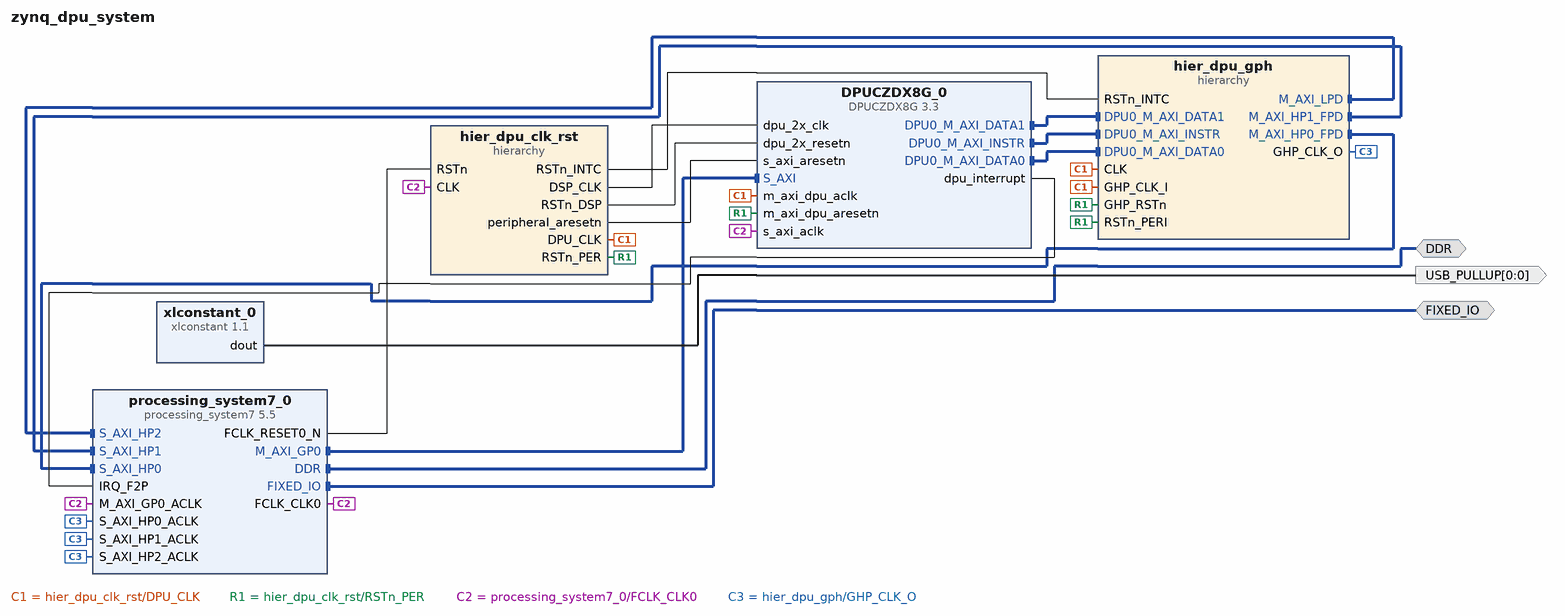
[diagram p0: block diagram of the top level]
# Vivado block design zynq_dpu_system, xc7z020clg484-1, Vivado 2020.2
create_bd_design zynq_dpu_system

create_bd_intf_port -mode Master -vlnv xilinx.com:interface:ddrx_rtl:1.0 DDR
create_bd_intf_port -mode Master -vlnv xilinx.com:display_processing_system7:fixedio_rtl:1.0 FIXED_IO
create_bd_port -dir O -from 0 -to 0 USB_PULLUP

create_bd_cell -type ip -vlnv xilinx.com:ip:processing_system7:5.5 processing_system7_0
set_property -dict [list \
  CONFIG.PCW_APU_PERIPHERAL_FREQMHZ 666.666667 \
  CONFIG.PCW_ENET0_ENET0_IO {MIO 16 .. 27} \
  CONFIG.PCW_ENET0_GRP_MDIO_ENABLE 1 \
  CONFIG.PCW_ENET0_GRP_MDIO_IO {MIO 52 .. 53} \
  CONFIG.PCW_ENET0_PERIPHERAL_ENABLE 1 \
  CONFIG.PCW_ENET0_RESET_ENABLE 0 \
  CONFIG.PCW_ENET_RESET_ENABLE 1 \
  CONFIG.PCW_ENET_RESET_SELECT {Share reset pin} \
  CONFIG.PCW_FPGA0_PERIPHERAL_FREQMHZ 100.000000 \
  CONFIG.PCW_FPGA1_PERIPHERAL_FREQMHZ 150.000000 \
  CONFIG.PCW_GPIO_MIO_GPIO_ENABLE 1 \
  CONFIG.PCW_GPIO_MIO_GPIO_IO MIO \
  CONFIG.PCW_I2C_RESET_ENABLE 1 \
  CONFIG.PCW_IRQ_F2P_INTR 1 \
  CONFIG.PCW_PRESET_BANK1_VOLTAGE {LVCMOS 1.8V} \
  CONFIG.PCW_QSPI_GRP_SINGLE_SS_ENABLE 1 \
  CONFIG.PCW_QSPI_GRP_SINGLE_SS_IO {MIO 1 .. 6} \
  CONFIG.PCW_QSPI_PERIPHERAL_ENABLE 1 \
  CONFIG.PCW_QSPI_QSPI_IO {MIO 1 .. 6} \
  CONFIG.PCW_SD0_GRP_CD_ENABLE 1 \
  CONFIG.PCW_SD0_GRP_CD_IO {MIO 47} \
  CONFIG.PCW_SD0_GRP_WP_ENABLE 1 \
  CONFIG.PCW_SD0_GRP_WP_IO {MIO 46} \
  CONFIG.PCW_SD0_PERIPHERAL_ENABLE 1 \
  CONFIG.PCW_SD0_SD0_IO {MIO 40 .. 45} \
  CONFIG.PCW_SDIO_PERIPHERAL_FREQMHZ 50 \
  CONFIG.PCW_SINGLE_QSPI_DATA_MODE x4 \
  CONFIG.PCW_TTC0_PERIPHERAL_ENABLE 1 \
  CONFIG.PCW_TTC0_TTC0_IO EMIO \
  CONFIG.PCW_UART1_PERIPHERAL_ENABLE 1 \
  CONFIG.PCW_UART1_UART1_IO {MIO 48 .. 49} \
  CONFIG.PCW_UART_PERIPHERAL_FREQMHZ 50 \
  CONFIG.PCW_UIPARAM_DDR_FREQ_MHZ 533.333313 \
  CONFIG.PCW_UIPARAM_DDR_PARTNO {MT41J128M16 HA-15E} \
  CONFIG.PCW_USB0_PERIPHERAL_ENABLE 1 \
  CONFIG.PCW_USB0_RESET_ENABLE 0 \
  CONFIG.PCW_USB0_USB0_IO {MIO 28 .. 39} \
  CONFIG.PCW_USB_RESET_ENABLE 1 \
  CONFIG.PCW_USB_RESET_SELECT {Share reset pin} \
  CONFIG.PCW_USE_FABRIC_INTERRUPT 1 \
  CONFIG.PCW_USE_S_AXI_HP0 1 \
  CONFIG.PCW_USE_S_AXI_HP1 1 \
  CONFIG.PCW_USE_S_AXI_HP2 1 \
  CONFIG.preset ZedBoard \
] [get_bd_cells processing_system7_0]
# 223 more settings of processing_system7_0 are not shown: defaults, MIO pin electricals, DDR timing, and values the tool derives
create_bd_cell -type ip -vlnv xilinx.com:ip:DPUCZDX8G:3.3 DPUCZDX8G_0
set_property -dict [list \
  CONFIG.ARCH 1152 \
  CONFIG.TIME_DAY 10 \
  CONFIG.TIME_HOUR 21 \
  CONFIG.TIME_MONTH 9 \
  CONFIG.TIME_QUARTER 1 \
  CONFIG.TIME_YEAR 21 \
] [get_bd_cells DPUCZDX8G_0]
create_bd_cell -type hier hier_dpu_clk_rst
create_bd_cell -type hier hier_dpu_gph
create_bd_cell -type ip -vlnv xilinx.com:ip:xlconstant:1.1 xlconstant_0

# ---- hierarchy /hier_dpu_clk_rst ----
current_bd_instance /hier_dpu_clk_rst
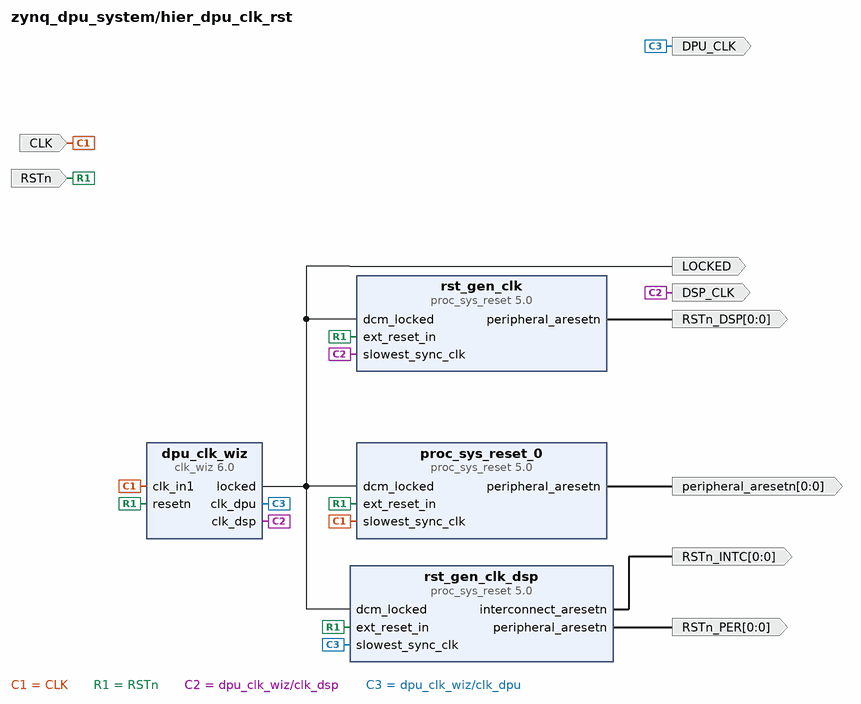
[diagram p1: block diagram inside /hier_dpu_clk_rst]
create_bd_pin -dir I RSTn
create_bd_pin -dir I CLK
create_bd_pin -dir O DSP_CLK
create_bd_pin -dir O DPU_CLK
create_bd_pin -dir O LOCKED
create_bd_pin -dir O -from 0 -to 0 RSTn_DSP
create_bd_pin -dir O -from 0 -to 0 RSTn_INTC
create_bd_pin -dir O -from 0 -to 0 RSTn_PER
create_bd_pin -dir O -from 0 -to 0 -type rst peripheral_aresetn

create_bd_cell -type ip -vlnv xilinx.com:ip:proc_sys_reset:5.0 rst_gen_clk
create_bd_cell -type ip -vlnv xilinx.com:ip:clk_wiz:6.0 dpu_clk_wiz
set_property -dict [list \
  CONFIG.CLKOUT1_DRIVES No_buffer \
  CONFIG.CLKOUT1_JITTER 102.037 \
  CONFIG.CLKOUT1_PHASE_ERROR 124.502 \
  CONFIG.CLKOUT1_REQUESTED_OUT_FREQ 650.000 \
  CONFIG.CLKOUT2_DRIVES No_buffer \
  CONFIG.CLKOUT2_JITTER 116.074 \
  CONFIG.CLKOUT2_PHASE_ERROR 124.502 \
  CONFIG.CLKOUT2_REQUESTED_OUT_FREQ 325.000 \
  CONFIG.CLKOUT2_USED true \
  CONFIG.CLKOUT3_DRIVES BUFG \
  CONFIG.CLKOUT4_DRIVES BUFG \
  CONFIG.CLKOUT5_DRIVES BUFG \
  CONFIG.CLKOUT6_DRIVES BUFG \
  CONFIG.CLKOUT7_DRIVES BUFG \
  CONFIG.CLK_IN1_BOARD_INTERFACE Custom \
  CONFIG.CLK_IN2_BOARD_INTERFACE Custom \
  CONFIG.CLK_OUT1_PORT clk_dsp \
  CONFIG.CLK_OUT2_PORT clk_dpu \
  CONFIG.FEEDBACK_SOURCE FDBK_ONCHIP \
  CONFIG.MMCM_BANDWIDTH OPTIMIZED \
  CONFIG.MMCM_CLKFBOUT_MULT_F 6.500 \
  CONFIG.MMCM_CLKOUT0_DIVIDE_F 1.000 \
  CONFIG.MMCM_CLKOUT1_DIVIDE 2 \
  CONFIG.MMCM_COMPENSATION ZHOLD \
  CONFIG.NUM_OUT_CLKS 2 \
  CONFIG.PRIMITIVE MMCM \
  CONFIG.PRIM_SOURCE Single_ended_clock_capable_pin \
  CONFIG.RESET_PORT resetn \
  CONFIG.RESET_TYPE ACTIVE_LOW \
  CONFIG.SECONDARY_SOURCE Single_ended_clock_capable_pin \
  CONFIG.USE_FREQ_SYNTH true \
  CONFIG.USE_PHASE_ALIGNMENT false \
] [get_bd_cells dpu_clk_wiz]
create_bd_cell -type ip -vlnv xilinx.com:ip:proc_sys_reset:5.0 rst_gen_clk_dsp
create_bd_cell -type ip -vlnv xilinx.com:ip:proc_sys_reset:5.0 proc_sys_reset_0

# ---- hierarchy /hier_dpu_gph ----
current_bd_instance /hier_dpu_gph
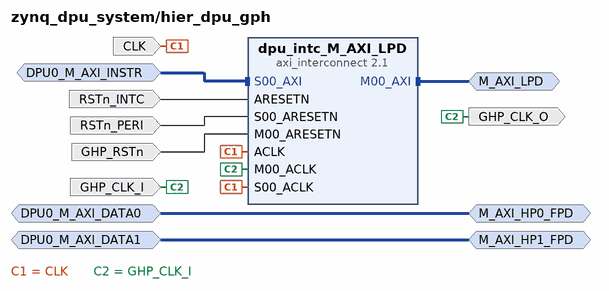
[diagram p2: block diagram inside /hier_dpu_gph]
create_bd_intf_pin -mode Slave -vlnv xilinx.com:interface:aximm_rtl:1.0 DPU0_M_AXI_DATA0
create_bd_intf_pin -mode Slave -vlnv xilinx.com:interface:aximm_rtl:1.0 DPU0_M_AXI_DATA1
create_bd_intf_pin -mode Slave -vlnv xilinx.com:interface:aximm_rtl:1.0 DPU0_M_AXI_INSTR
create_bd_intf_pin -mode Master -vlnv xilinx.com:interface:aximm_rtl:1.0 M_AXI_HP0_FPD
create_bd_intf_pin -mode Master -vlnv xilinx.com:interface:aximm_rtl:1.0 M_AXI_HP1_FPD
create_bd_intf_pin -mode Master -vlnv xilinx.com:interface:aximm_rtl:1.0 M_AXI_LPD
create_bd_pin -dir I CLK
create_bd_pin -dir I RSTn_INTC
create_bd_pin -dir I RSTn_PERI
create_bd_pin -dir I GHP_RSTn
create_bd_pin -dir I GHP_CLK_I
create_bd_pin -dir O GHP_CLK_O

create_bd_cell -type ip -vlnv xilinx.com:ip:axi_interconnect:2.1 dpu_intc_M_AXI_LPD
set_property -dict {CONFIG.NUM_MI 1 CONFIG.NUM_SI 1} [get_bd_cells dpu_intc_M_AXI_LPD]

# ---- connections ----

current_bd_instance /hier_dpu_clk_rst
connect_bd_net -net clk_wiz_0_locked [get_bd_pins dpu_clk_wiz/locked] \
  [get_bd_pins rst_gen_clk_dsp/dcm_locked] [get_bd_pins rst_gen_clk/dcm_locked] [get_bd_pins LOCKED] \
  [get_bd_pins proc_sys_reset_0/dcm_locked]
connect_bd_net [get_bd_pins CLK] [get_bd_pins dpu_clk_wiz/clk_in1] [get_bd_pins proc_sys_reset_0/slowest_sync_clk]
connect_bd_net [get_bd_pins RSTn] \
  [get_bd_pins dpu_clk_wiz/resetn] [get_bd_pins rst_gen_clk/ext_reset_in] [get_bd_pins rst_gen_clk_dsp/ext_reset_in] \
  [get_bd_pins proc_sys_reset_0/ext_reset_in]
connect_bd_net [get_bd_pins dpu_clk_wiz/clk_dsp] [get_bd_pins rst_gen_clk/slowest_sync_clk] [get_bd_pins DSP_CLK]
connect_bd_net [get_bd_pins dpu_clk_wiz/clk_dpu] [get_bd_pins rst_gen_clk_dsp/slowest_sync_clk] [get_bd_pins DPU_CLK]
connect_bd_net [get_bd_pins rst_gen_clk/peripheral_aresetn] [get_bd_pins RSTn_DSP]
connect_bd_net [get_bd_pins rst_gen_clk_dsp/interconnect_aresetn] [get_bd_pins RSTn_INTC]
connect_bd_net [get_bd_pins rst_gen_clk_dsp/peripheral_aresetn] [get_bd_pins RSTn_PER]
connect_bd_net [get_bd_pins proc_sys_reset_0/peripheral_aresetn] [get_bd_pins peripheral_aresetn]

current_bd_instance /hier_dpu_gph
connect_bd_intf_net [get_bd_intf_pins M_AXI_LPD] [get_bd_intf_pins dpu_intc_M_AXI_LPD/M00_AXI]
connect_bd_intf_net [get_bd_intf_pins DPU0_M_AXI_INSTR] [get_bd_intf_pins dpu_intc_M_AXI_LPD/S00_AXI]
connect_bd_intf_net -intf_net DPU0_M_AXI_DATA0_1 [get_bd_intf_pins DPU0_M_AXI_DATA0] [get_bd_intf_pins M_AXI_HP0_FPD]
connect_bd_intf_net -intf_net DPU0_M_AXI_DATA1_1 [get_bd_intf_pins DPU0_M_AXI_DATA1] [get_bd_intf_pins M_AXI_HP1_FPD]
connect_bd_net [get_bd_pins CLK] [get_bd_pins dpu_intc_M_AXI_LPD/ACLK] [get_bd_pins dpu_intc_M_AXI_LPD/S00_ACLK]
connect_bd_net [get_bd_pins RSTn_INTC] [get_bd_pins dpu_intc_M_AXI_LPD/ARESETN]
connect_bd_net [get_bd_pins RSTn_PERI] [get_bd_pins dpu_intc_M_AXI_LPD/S00_ARESETN]
connect_bd_net [get_bd_pins GHP_CLK_I] [get_bd_pins dpu_intc_M_AXI_LPD/M00_ACLK] [get_bd_pins GHP_CLK_O]
connect_bd_net [get_bd_pins GHP_RSTn] [get_bd_pins dpu_intc_M_AXI_LPD/M00_ARESETN]

current_bd_instance /
connect_bd_intf_net [get_bd_intf_ports DDR] [get_bd_intf_pins processing_system7_0/DDR]
connect_bd_intf_net [get_bd_intf_ports FIXED_IO] [get_bd_intf_pins processing_system7_0/FIXED_IO]
connect_bd_intf_net [get_bd_intf_pins processing_system7_0/M_AXI_GP0] [get_bd_intf_pins DPUCZDX8G_0/S_AXI]
connect_bd_intf_net [get_bd_intf_pins hier_dpu_gph/M_AXI_LPD] [get_bd_intf_pins processing_system7_0/S_AXI_HP2]
connect_bd_intf_net [get_bd_intf_pins hier_dpu_gph/M_AXI_HP1_FPD] [get_bd_intf_pins processing_system7_0/S_AXI_HP1]
connect_bd_intf_net [get_bd_intf_pins hier_dpu_gph/M_AXI_HP0_FPD] [get_bd_intf_pins processing_system7_0/S_AXI_HP0]
connect_bd_intf_net [get_bd_intf_pins DPUCZDX8G_0/DPU0_M_AXI_DATA1] [get_bd_intf_pins hier_dpu_gph/DPU0_M_AXI_DATA1]
connect_bd_intf_net [get_bd_intf_pins DPUCZDX8G_0/DPU0_M_AXI_INSTR] [get_bd_intf_pins hier_dpu_gph/DPU0_M_AXI_INSTR]
connect_bd_intf_net [get_bd_intf_pins DPUCZDX8G_0/DPU0_M_AXI_DATA0] [get_bd_intf_pins hier_dpu_gph/DPU0_M_AXI_DATA0]
connect_bd_net [get_bd_pins hier_dpu_clk_rst/DSP_CLK] [get_bd_pins DPUCZDX8G_0/dpu_2x_clk]
connect_bd_net [get_bd_pins hier_dpu_clk_rst/DPU_CLK] \
  [get_bd_pins DPUCZDX8G_0/m_axi_dpu_aclk] [get_bd_pins hier_dpu_gph/CLK] [get_bd_pins hier_dpu_gph/GHP_CLK_I]
connect_bd_net [get_bd_pins DPUCZDX8G_0/dpu_interrupt] [get_bd_pins processing_system7_0/IRQ_F2P]
connect_bd_net [get_bd_pins hier_dpu_clk_rst/RSTn_DSP] [get_bd_pins DPUCZDX8G_0/dpu_2x_resetn]
connect_bd_net [get_bd_pins hier_dpu_clk_rst/RSTn_INTC] [get_bd_pins hier_dpu_gph/RSTn_INTC]
connect_bd_net [get_bd_pins hier_dpu_clk_rst/RSTn_PER] \
  [get_bd_pins DPUCZDX8G_0/m_axi_dpu_aresetn] [get_bd_pins hier_dpu_gph/GHP_RSTn] [get_bd_pins hier_dpu_gph/RSTn_PERI]
connect_bd_net -net CLK_1 [get_bd_pins processing_system7_0/FCLK_CLK0] \
  [get_bd_pins hier_dpu_clk_rst/CLK] [get_bd_pins DPUCZDX8G_0/s_axi_aclk] [get_bd_pins processing_system7_0/M_AXI_GP0_ACLK]
connect_bd_net [get_bd_pins hier_dpu_gph/GHP_CLK_O] \
  [get_bd_pins processing_system7_0/S_AXI_HP0_ACLK] [get_bd_pins processing_system7_0/S_AXI_HP1_ACLK] \
  [get_bd_pins processing_system7_0/S_AXI_HP2_ACLK]
connect_bd_net -net RSTn_1 [get_bd_pins processing_system7_0/FCLK_RESET0_N] [get_bd_pins hier_dpu_clk_rst/RSTn]
connect_bd_net [get_bd_pins hier_dpu_clk_rst/peripheral_aresetn] [get_bd_pins DPUCZDX8G_0/s_axi_aresetn]
connect_bd_net [get_bd_pins xlconstant_0/dout] [get_bd_ports USB_PULLUP]

# ---- address map ----
assign_bd_address -offset 0x0000000000 -range 512M -target_address_space [get_bd_addr_spaces DPUCZDX8G_0/DPU0_M_AXI_DATA0] [get_bd_addr_segs processing_system7_0/S_AXI_HP0/HP0_DDR_LOWOCM]
assign_bd_address -offset 0x0000000000 -range 512M -target_address_space [get_bd_addr_spaces DPUCZDX8G_0/DPU0_M_AXI_DATA1] [get_bd_addr_segs processing_system7_0/S_AXI_HP1/HP1_DDR_LOWOCM]
assign_bd_address -offset 0x0000000000 -range 512M -target_address_space [get_bd_addr_spaces DPUCZDX8G_0/DPU0_M_AXI_INSTR] [get_bd_addr_segs processing_system7_0/S_AXI_HP2/HP2_DDR_LOWOCM]
assign_bd_address -offset 0x40000000 -range 16M -target_address_space [get_bd_addr_spaces processing_system7_0/Data] [get_bd_addr_segs DPUCZDX8G_0/S_AXI/reg0]

validate_bd_design
save_bd_design
